# Altium project BQ24650_EVM.PrjPcb
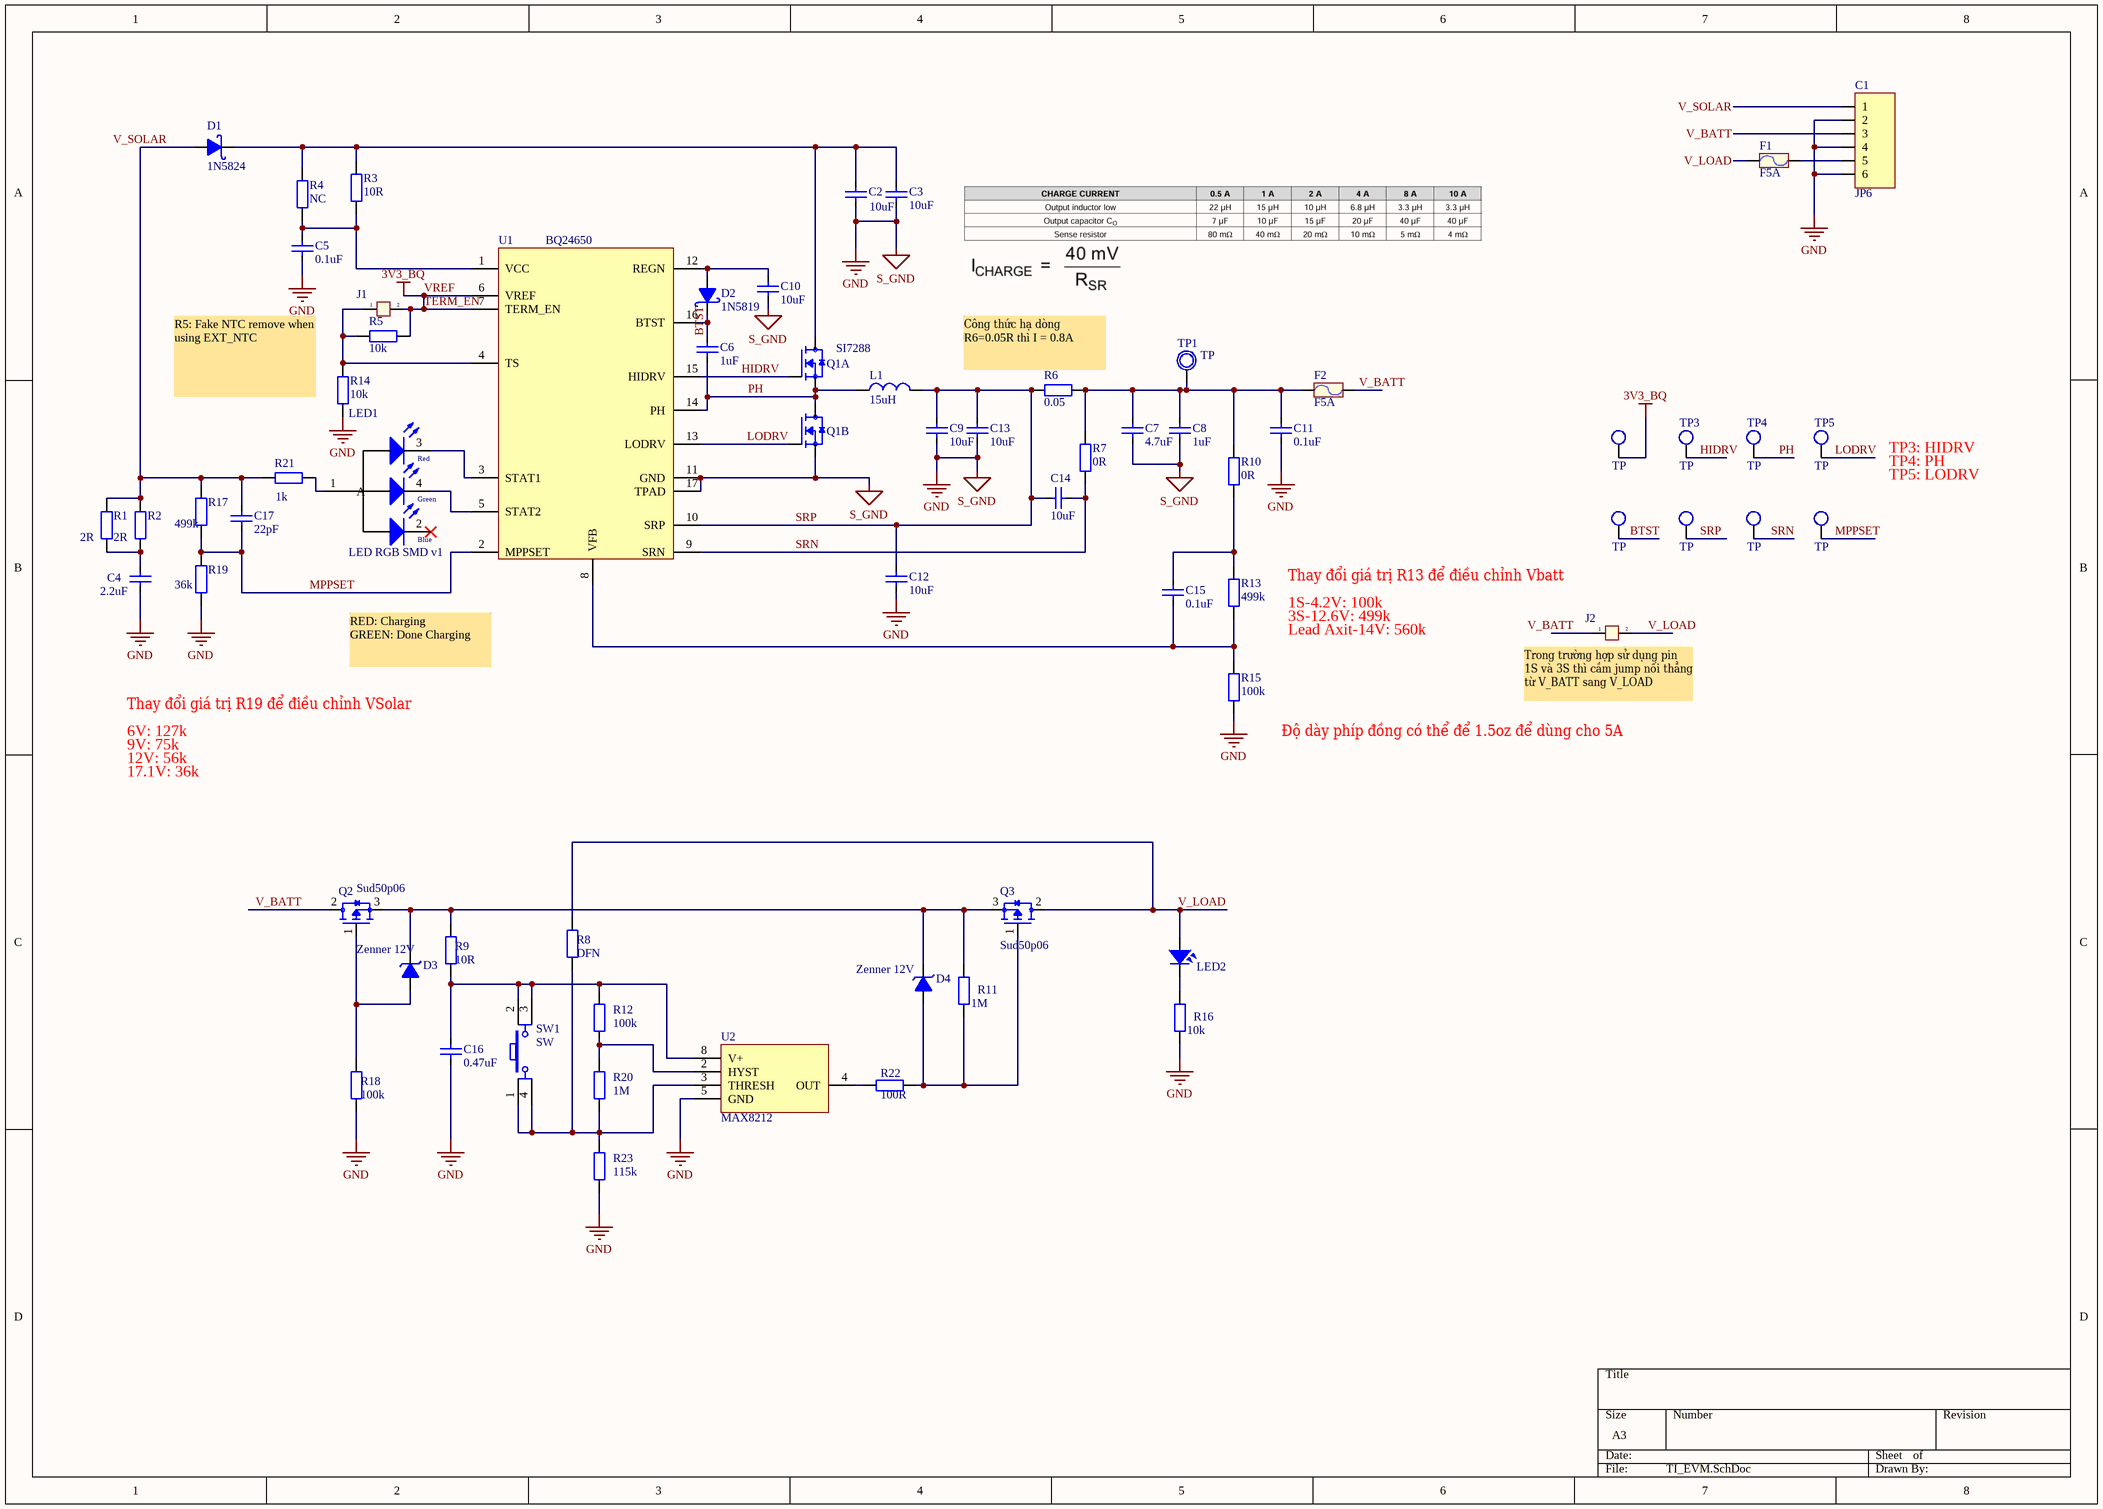
[diagram p0: TI_EVM.SchDoc]
1 sheet, 66 parts. Net scope: global (net labels, ports and power ports of the same name join across sheets).
Board file: TI_EVM.PcbDoc

## Sheet TI_EVM.SchDoc
size A3; SheetNumber: 1; SheetTotal: 1

### Parts
C1  JP6  [HB9500-6P]
C2  10uF  [CAP_3216]
C3  10uF  [CAP_3216]
C4  2.2uF  [CAP_0805]
C5  0.1uF  [CAP_0805]
C6  1uF  [CAP_0805]
C7  4.7uF  [CAP_1206]
C8  1uF  [CAP_1206]
C9  10uF  [CAP_1206]
C10  10uF  [CAP_0805]
C11  0.1uF  [CAP_0805]
C12  10uF  [CAP_0805]
C13  10uF  [CAP_1206]
C14  10uF  [CAP_0805]
C15  0.1uF  [CAP_0805]
C16  0.47uF  [CAP_0805]
C17  22pF  [CAP_0805]
D1  1N5824  [SMA]
D2  1N5819  [SMA]
D3  Zenner 12V  [DIODE_ZENER_SMD]
D4  Zenner 12V  [DIODE_ZENER_SMD]
F1  F5A  [RES-SMD-1812]
F2  F5A  [RES-SMD-1812]
J1  Jumper 2  [JP2]  (value not drawn)  (no BOM)
J2  Jumper 2  [JP2]  (value not drawn)  (no BOM)
L1  15uH  [L-SMD-M-12x10]
LED1  LED RGB SMD v1  [LED RGB 3528]
LED2  LED  [LED 3512]  (value not drawn)
Q1  SI7288  [SO-8 dual]  (parts A,B of 2)
Q2  Sud50p06  [TO-252]
Q3  Sud50p06  [TO-252]
R1  2R  [RES-SMD-2512]
R2  2R  [RES-SMD-2512]
R3  10R  [RES-SMD-0805]
R4  NC  [RES-SMD-0805]
R5  10k  [RES-SMD-0805]
R6  0.05  [RES-SMD-2512]
R7  0R  [RES-SMD-0805]
R8  DFN  [RES-SMD-0805]
R9  10R  [RES-SMD-0805]
R10  0R  [RES-SMD-0805]
R11  1M  [RES-SMD-0805]
R12  100k  [RES-SMD-0805]
R13  499k  [RES-SMD-0805]
R14  10k  [RES-SMD-0805]
R15  100k  [RES-SMD-0805]
R16  10k  [RES-SMD-0805]
R17  499k  [RES-SMD-0805]
R18  100k  [RES-SMD-0805]
R19  36k  [RES-SMD-0805]
R20  1M  [RES-SMD-0805]
R21  1k  [RES-SMD-0805]
R22  100R  [RES-SMD-0805]
R23  115k  [RES-SMD-0805]
SW1  SW  [SW4]
TP1  TP  [TP1]  (no BOM)
TP2  TP  [Testpoint 50ml]  (no BOM)
TP3  TP  [Testpoint 50ml]  (no BOM)
TP4  TP  [Testpoint 50ml]  (no BOM)
TP5  TP  [Testpoint 50ml]  (no BOM)
TP6  TP  [Testpoint 50ml]  (no BOM)
TP7  TP  [Testpoint 50ml]  (no BOM)
TP8  TP  [Testpoint 50ml]  (no BOM)
TP9  TP  [Testpoint 50ml]  (no BOM)
U1  BQ24650  [VQFN-16]
U2  MAX8212  [SOIC-8]

### Nets
GND: C1.2 C1.4 C1.6 C2.1 C3.1 C4.1 C5.1 C7.2 C8.2 C9.1 C10.1 C11.1 C12.1 C13.1 C16.1 Q1.3(S2) R14.2 R15.2 R16.2 R18.2 R19.2 R23.2 U1.11(GND) U1.17(TPAD) U2.5(GND)  [also labelled S_GND]
TERM_EN: J1.2 R5.2 TP2.1 U1.6(VREF) U1.7(TERM_EN)  [also labelled 3V3_BQ, VREF]
BTST: C6.2 D2.2(K) TP6.1 U1.16(BTST)
HIDRV: Q1.2(G1) TP3.1 U1.15(HIDRV)
LODRV: Q1.4(G2) TP5.1 U1.13(LODRV)
MPPSET: C17.1 R17.2 R19.1 TP9.1 U1.2(MPPSET)
PH: C6.1 L1.1 Q1.1(S1) Q1.5_6_10(D2) TP4.1 U1.14(PH)
SRN: C14.1 R7.2 TP8.1 U1.9(SRN)
SRP: C9.2 C12.2 C13.2 C14.2 L1.2 R6.2 TP7.1 U1.10(SRP)
V_BATT: C1.3 F2.2 J2.1 Q2.2(D)
V_LOAD: F1.1 J2.2 LED2.1 Q3.2(D) R8.1
V_SOLAR: C1.1 C17.2 D1.1(A) R1.1 R2.1 R17.1 R21.2
NetC1_5: C1.5 F1.2
NetC2_2: C2.2 C3.2 D1.2(K) Q1.7_8_9(D1) R3.1 R4.1
NetC4_2: C4.2 R1.2 R2.2
NetC5_2: C5.2 R3.2 R4.2 U1.1(VCC)
NetC7_1: C7.1 C8.1 C11.2 F2.1 R6.1 R7.1 R10.1 TP1.1
NetC10_2: C10.2 D2.1(A) U1.12(REGN)
NetC15_1: C15.1 R13.2 R15.1 U1.8(VFB)
NetC15_2: C15.2 R10.2 R13.1
NetC16_2: C16.2 R9.2 R12.1 SW1.2 SW1.3 U2.8(V+)
NetD3_1: D3.1(A) Q2.1(G) R18.1
NetD3_2: D3.2(K) D4.2(K) Q2.3(S) Q3.3(S) R9.1 R11.1
NetD4_1: D4.1(A) Q3.1(G) R11.2 R22.2
NetJ1_1: J1.1 R5.1 R14.1 U1.4(TS)
NetLED1_1: LED1.1(A) R21.1
NetLED1_3: LED1.3(C2) U1.3(STAT1)
NetLED1_4: LED1.4(C1) U1.5(STAT2)
NetLED2_2: LED2.2 R16.1
NetR8_2: R8.2 R20.2 R23.1 SW1.1 SW1.4 U2.3(THRESH)
NetR12_2: R12.2 R20.1 U2.2(HYST)
NetR22_1: R22.1 U2.4(OUT)

Not connected (* = marked no-connect by the designer): LED1 2(C3)*

### Notes on the sheet
- (near R6) Công thức hạ dòng R6=0.05R thì I = 0.8A
- (near R14) R5: Fake NTC remove when using EXT_NTC
- TP3: HIDRV
- TP4: PH
- TP5: LODRV
- Thay đổi giá trị R13 để điều chỉnh Vbatt
- 1S-4.2V: 100k
- 3S-12.6V: 499k
- Lead Axit-14V: 560k
- Thay đổi giá trị R19 để điều chỉnh VSolar
- RED: Charging
  GREEN: Done Charging
- (near J2) Trong trường hợp sử dụng pin 1S và 3S thì cắm jump nối thẳng từ V_BATT sang V_LOAD
- 6V: 127k
- 9V: 75k
- 12V: 56k
- 17.1V: 36k
- (near R15) Độ dày phíp đồng có thể để 1.5oz để dùng cho 5A
- (in symbol LED RGB SMD v1) Red; Green; Blue

### Library data of the parts
C1 = JP6: WR-PHD 2.54 mm Angled Socket Header; Manufacturer: W¨¹rth Elektronik eiSos GmbH; partNo: 613006143121; ComponentLink1 Description: Manufacturer; ComponentLink2 Description: Datasheet; NoPins: 06; Created Date: 29 March 2013; ComponentLink1URL: http://www.we-online.com; ComponentLink2URL: http://katalog.we-online.de/em/datasheet/6130xx143121.pdf; Created by: Karrer Zheng
C2 C3 = CapSMD: Capacitor; Value: 33p; Published: 8-Jun-2000; LatestRevisionDate: 17-Jul-2002; LatestRevisionNote: Re-released for DXP Platform.; PackageReference: RAD-0.3; Publisher: Altium Limited
C4-C6 C10-C12 C14-C17 = CapSMD: C_0805; Value: 33p; Published: 8-Jun-2000; LatestRevisionDate: 17-Jul-2002; LatestRevisionNote: Re-released for DXP Platform.; PackageReference: RAD-0.3; Publisher: Altium Limited
C7-C9 C13 = CapSMD: C_1206; Value: 33p; Published: 8-Jun-2000; LatestRevisionDate: 17-Jul-2002; LatestRevisionNote: Re-released for DXP Platform.; PackageReference: RAD-0.3; Publisher: Altium Limited
D1 = 1N5822: SS54 Diode Schottky 5A 40V; Value: Diode c?m 1N5408
D2 = 1N5822: S4 Diode Schottky 1A 40V; Value: Diode c?m 1N5408
D3 D4 = Zenner: generic zenner diode
F1 F2 = Fuse: Fuse 5A; Designed by: VanDungEvn; Value: Fuse
J1 J2 = JP 2: Value: JP 2
L1 = Inductor: Value: 150 mH
LED2 = LED SMD: Value: LED 3 - 5 ly 2 Colour
Q1 = Dual MOSFET-N
Q2 Q3 = MOSFET-P
R1 R2 R6 = Resistor - SMD: R_2512; Manufacturer: Generic Components; Class: Passive; Published: 08/06/2000; Publisher: Altium Hobart Technology Centre
R3-R5 R7-R23 = Resistor - SMD: R_0805; Manufacturer: Generic Components; Class: Passive; Published: 08/06/2000; Publisher: Altium Hobart Technology Centre
SW1 = SW4: Switch button 4 pin; Value: Button chip 4 pin
TP1 = TP1: Test Point; Value: Test Point
TP2-TP9 = TP_1: Test Point; Value: Test Point
U1 = BQ24650: BQ24650 Stand-Alone Synchronous Buck Battery Charge Controller for Solar Power / With Maximum Power Point Tracking
U2 = MAX8212: Microprocessor Voltage Monitors / with Programmable Voltage Detection